# Altium project IR2101+irfz44.PrjPcb
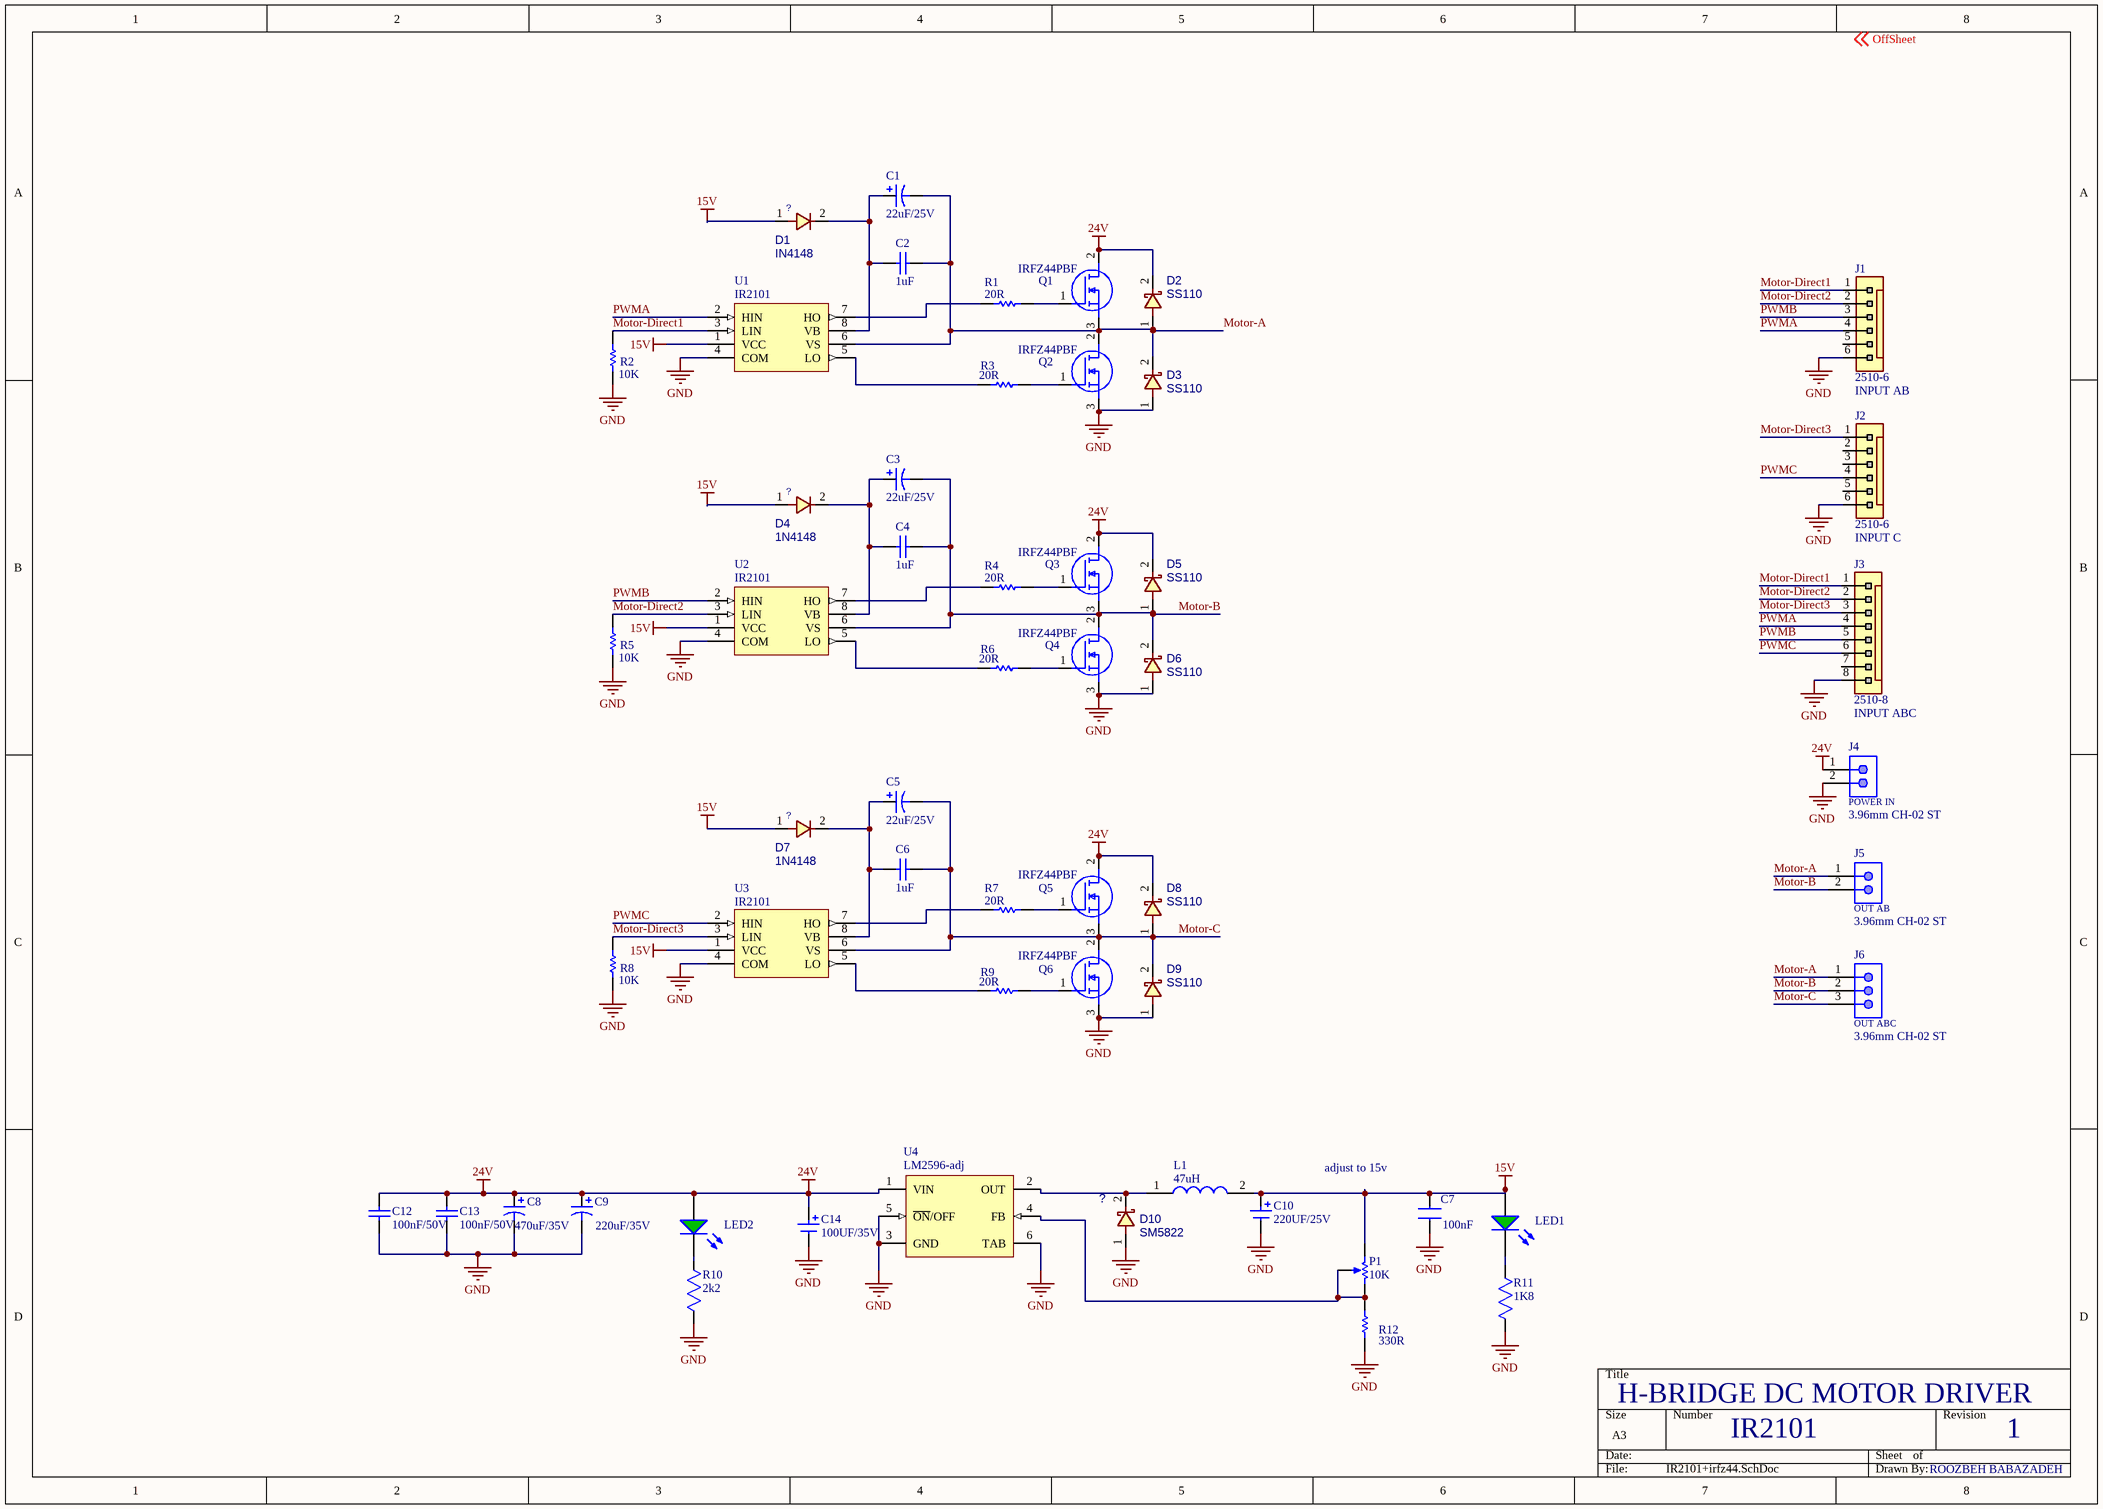
[diagram p0: IR2101+irfz44.SchDoc]
1 sheet, 55 parts. Net scope: global (net labels, ports and power ports of the same name join across sheets).
Board file: IR2101+irfz44.PcbDoc

## Sheet IR2101+irfz44.SchDoc
size A3

### Parts
C1  22uF/25V  [C_EL_6X11]
C2  1uF  [C0805E]
C3  22uF/25V  [C_EL_6X11]
C4  1uF  [C0805E]
C5  22uF/25V  [C_EL_6X11]
C6  1uF  [C0805E]
C7  100nF  [C0805E]
C8  470uF/35V  [C_EL_10X12]
C9  220uF/35V  [C_EL_10X12]
C10  220UF/25V  [C_EL_10X12]
C12  100nF/50V  [C_PLY_7X6]
C13  100nF/50V  [C_PLY_7X6]
C14  100UF/35V  [C_EL_10X12]
D1  IN4148  [D_SOD123W]
D2  SS110  [D_SMA]
D3  SS110  [D_SMA]
D4  1N4148  [D_SOD123W]
D5  SS110  [D_SMA]
D6  SS110  [D_SMA]
D7  1N4148  [D_SOD123W]
D8  SS110  [D_SMA]
D9  SS110  [D_SMA]
D10  SM5822  [D_SMB]
J1  2510-6  value INPUT AB  [WF_6]
J2  2510-6  value INPUT C  [WF_6]
J3  2510-8  value INPUT ABC  [WF_8]
J4  POWER IN  Packaging: 3.96mm CH-02 ST  [PWL_2]
J5  OUT AB  Packaging: 3.96mm CH-02 ST  [PWL_2]
J6  OUT ABC  Packaging: 3.96mm CH-02 ST  [PWL_3]
L1  47uH  [CDRH127LDNP560MC-12*12]
LED1  LED3mm  [LED1206RED]  (value not drawn)
LED2  LED3mm  [LED1206RED]  (value not drawn)
P1  10K  [POT_3296W]
Q1  IRFZ44PBF  [TO-254]
Q2  IRFZ44PBF  [TO-254]
Q3  IRFZ44PBF  [TO-254]
Q4  IRFZ44PBF  [TO-254]
Q5  IRFZ44PBF  [TO-254]
Q6  IRFZ44PBF  [TO-254]
R1  20R  [R0805]
R2  10K  [R0805]
R3  20R  [R0805]
R4  20R  [R0805]
R5  10K  [R0805]
R6  20R  [R0805]
R7  value 20R  [R0805]  (hidden comment: Res1)
R8  10K  [R0805]
R9  value 20R  [R0805]  (hidden comment: Res1)
R10  2k2  [R0805]
R11  1K8  [R0805]
R12  330R  [R0805]
U1  IR2101  [SO_8]
U2  IR2101  [SO_8]
U3  IR2101  [SO_8]
U4  LM2596-adj  [to-263-5 5d2pak LM2596S]

### Nets
15V: C7.2 C10.1 D1.1 D4.1 D7.1 L1.2 LED1.1(A) P1.3(BOT) U1.1(VCC) U2.1(VCC) U3.1(VCC)
24V: C8.1 C9.1 C12.2 C13.2 C14.1 D2.2 D5.2 D8.2 J4.1 LED2.1(A) Q1.2(D) Q3.2(D) Q5.2(D) U4.1(VIN)
GND: C7.1 C8.2 C9.2 C10.2 C12.1 C13.1 C14.2 D3.1 D6.1 D9.1 D10.1 J1.6 J2.6 J3.8 J4.2 Q2.3(S) Q4.3(S) Q6.3(S) R2.1 R5.1 R8.1 R10.2 R11.2 R12.1 U1.4(COM) U2.4(COM) U3.4(COM) U4.3(GND) U4.5(~{ON}/OFF) U4.6(TAB)
Motor-A: C1.2 C2.2 D2.1 D3.2 J5.1 J6.1 Q1.3(S) Q2.2(D) U1.6(VS)
Motor-B: C3.2 C4.2 D5.1 D6.2 J5.2 J6.2 Q3.3(S) Q4.2(D) U2.6(VS)
Motor-C: C5.2 C6.2 D8.1 D9.2 J6.3 Q5.3(S) Q6.2(D) U3.6(VS)
Motor-Direct1: J1.1 J3.1 R2.2 U1.3(LIN)
Motor-Direct2: J1.2 J3.2 R5.2 U2.3(LIN)
Motor-Direct3: J2.1 J3.3 R8.2 U3.3(LIN)
PWMA: J1.4 J3.4 U1.2(HIN)
PWMB: J1.3 J3.5 U2.2(HIN)
PWMC: J2.4 J3.6 U3.2(HIN)
NetC1_1: C1.1 C2.1 D1.2 U1.8(VB)
NetC3_1: C3.1 C4.1 D4.2 U2.8(VB)
NetC5_1: C5.1 C6.1 D7.2 U3.8(VB)
NetD10_2: D10.2 L1.1 U4.2(OUT)
NetLED1_2: LED1.2(K) R11.1
NetLED2_2: LED2.2(K) R10.1
NetP1_1: P1.1(TOP) P1.2(TAP) R12.2 U4.4(FB)
NetQ1_1: Q1.1(G) R1.2
NetQ2_1: Q2.1(G) R3.2
NetQ3_1: Q3.1(G) R4.2
NetQ4_1: Q4.1(G) R6.2
NetQ5_1: Q5.1(G) R7.2
NetQ6_1: Q6.1(G) R9.2
NetR1_1: R1.1 U1.7(HO)
NetR3_1: R3.1 U1.5(LO)
NetR4_1: R4.1 U2.7(HO)
NetR6_1: R6.1 U2.5(LO)
NetR7_1: R7.1 U3.7(HO)
NetR9_1: R9.1 U3.5(LO)

Not connected (* = marked no-connect by the designer): J1 5; J2 2 3 5; J3 7

### Notes on the sheet
- (near C7) adjust to 15v
- H-BRIDGE DC MOTOR DRIVER
- IR2101
- 1
- ROOZBEH BABAZADEH
- Labels drawn without touching a wire or pin: OffSheet

### Library data of the parts
C1 C3 C5 = Cap Pol1: Polarized Capacitor (Radial); Value: 22uF; Published: 8-Jun-2000; LatestRevisionDate: 17-Jul-2002; LatestRevisionNote: Re-released for DXP Platform.; PackageReference: RB7.6-15; Publisher: Altium Limited; PackageDescription: Polarized Capacitor (Radial); 2 Leads
C2 C4 C6 = Cap: Capacitor; Published: 8-Jun-2000; LatestRevisionDate: 17-Jul-2002; LatestRevisionNote: Re-released for DXP Platform.; PackageReference: RAD-0.3; Publisher: Altium Limited; PackageDescription: Radial Cap, Thru-Hole; 2 Leads; 0.3 in Pin Spacing; Value: 1uF
C7 = C
C8 C9 = Cap 220uF: 63VDC
C10 C14 = CAP_ELECTRO_POLIMER
C12 = Cap 100nF
C13 = Cap: 63VDC; Value: 10nF; Published: 8-Jun-2000; LatestRevisionDate: 17-Jul-2002; LatestRevisionNote: Re-released for DXP Platform.; PackageReference: RAD-0.3; Publisher: Altium Limited; PackageDescription: Radial Cap, Thru-Hole; 2 Leads; 0.3 in Pin Spacing
D1 D4 D7 = DIODE: DIODE, GENERAL PURPOSE, 50V/1A; DESC: DESCRIPTION; PARAM: 50V; PARAM2: 1A; MANF_P#: 1N4001; MANF: MANF; ASSEMBLY: ASSEMBLY; PRICE: PRICE; VALUE: ?
D2 D3 D5 D6 D8-D10 = SCHOTTKY: DIODE, SCHOTTKY, 40V, 1A; MANF: DIODES; MANF_P#: 1N5819HW-7-F; DESC: DESCRIPTION; ASSEMBLY: ASSEMBLY; PRICE: PRICE; PARAM2: 1A; PARAM: 40V; VALUE: ?
J1 J2 = HDRWF_6: Header, WF, Pitch: 2.54mm
J3 = HDRWF_8: Header, WF, Pitch: 2.54mm; DESC: INPUT ABC
J4 = sip 2: CH-02 ST pitch 3.96mm, Single Row, Vertical, 2pin; Part Number: 61300211121; Pin Number: 2; Gender: Male; Rated Current: 3A; Working Voltage: 250VAC; Withstanding Voltage: 500VAC; Contact Resistance: 20mOhm; ComponentLink1Description: Manufacturer; ComponentLink1URL: http://www.we-online.de; ComponentLink2Description: Datasheet; ComponentLink2URL: https://katalog.we-online.de/em/datasheet/6130xx11121.pdf; Published Date: June 2019; Publisher: Wurth Elektronik; Pitch: 3.96mm; Operating Temperature: -40 to +105degC; Mounting Technology: THT; Row Number: Single; Orientation: Vertical
J5 = sip 2: CH-02 ST pitch 3.96mm, Single Row, Vertical, 2pin; Part Number: 61300211121; Gender: Male; Rated Current: 3A; Working Voltage: 250VAC; Withstanding Voltage: 500VAC; Contact Resistance: 20mOhm; ComponentLink1Description: Manufacturer; ComponentLink1URL: http://www.we-online.de; ComponentLink2Description: Datasheet; ComponentLink2URL: https://katalog.we-online.de/em/datasheet/6130xx11121.pdf; Published Date: June 2019; Publisher: Wurth Elektronik; Pitch: 3.96mm; Operating Temperature: -40 to +105degC; Mounting Technology: THT; Row Number: Single; Orientation: Vertical
J6 = sip 3: CH-02 STpitch 3.96mm, Single Row, Vertical, 3pin; Part Number: 61300311121; Pin Number: 3; Pitch: 1; Gender: Male; Rated Current: 3A; Working Voltage: 250VAC; Withstanding Voltage: 500VAC; Contact Resistance: 20mOhm; ComponentLink1Description: Manufacturer; ComponentLink1URL: http://www.we-online.de; ComponentLink2Description: Datasheet; ComponentLink2URL: https://katalog.we-online.de/em/datasheet/6130xx11121.pdf; Published Date: June 2019; Publisher: Wurth Elektronik; Operating Temperature: -40 to +105degC; Mounting Technology: THT; Row Number: Single; Orientation: Vertical
L1 = CDRH127_LDNP-560MC: Inductor; Manufacturer_Name: Sumida; Manufacturer_Part_Number: CDRH127/LDNP-560MC; Datasheet Link: https://www.arrow.com/en/products/cdrh127ldnp-560mc/sumida; Height: 8mm; Arrow Part Number: CDRH127/LDNP-560MC; Arrow Price/Stock: https://www.arrow.com/en/products/cdrh127ldnp-560mc/sumida; Mouser Part Number: 851-CDRH127LDNP560MC; Mouser Price/Stock: https://www.mouser.co.uk/ProductDetail/Sumida/CDRH127-LDNP-560MC?qs=IXCoV6m%252B579ap3iATSRauQ%3D%3D
P1 = Multi-Turn: Potentiometer
Q1-Q6 = IRFZ44PBF: MOSFET (N-Channel); Manufacturer_Name: Vishay; Datasheet Link: https://www.vishay.com/docs/91291/91291.pdf; Height: 4.65mm; Manufacturer_Part_Number: IRFZ44PBF; Arrow Part Number: IRFZ44PBF; Arrow Price/Stock: https://www.arrow.com/en/products/irfz44pbf/vishay; Mouser Part Number: 844-IRFZ44PBF; Mouser Price/Stock: https://www.mouser.co.uk/ProductDetail/Vishay-Semiconductors/IRFZ44PBF?qs=%2FRKvNCQzLu0R%252BpFoqVUQ5w%3D%3D
R1-R9 R12 = Res1: Resistor; Published: 8-Jun-2000; LatestRevisionDate: 17-Jul-2002; LatestRevisionNote: Re-released for DXP Platform.; PackageReference: AXIAL-0.3; Publisher: Altium Limited; PackageDescription: Axial Device, Thru-Hole; 2 Leads; 0.3 in Pin Spacing
  R1 R3 R4 R6: Value: 20R
  R2 R5 R8: Value: 10K
  R12: Value: 330R
R10 R11 = R
U1-U3 = IR2101: High and Low Side Driver; Published: 8-Jun-2000; LatestRevisionDate: 04-Mar-2005; LatestRevisionNote: Stylized 3D Model Added.; DatasheetVersion: PD60043J; PackageReference: PDIP8; Publisher: Altium Limited; PackageDescription: DIP; 8 Leads; Row Spacing 7.62 mm; Pitch 2.54 mm; Code_JEDEC: MO-001-AN; ComponentLink1Description: Manufacturer Link; ComponentLink1URL: http://www.irf.com/
U4 = LM2596s